# Altium schematic sheet TSAL.SchDoc: QUTMS - HVBoard - TSAL
size A4; Author: Jonn Dillon; Organization: QUT Motorsport; Address1: O-120; Address2: O Block; Address3: QUT Gardens Point; Address4: Brisbane, 4000; DocumentNumber: 3; SheetNumber: 3; SheetTotal: 7
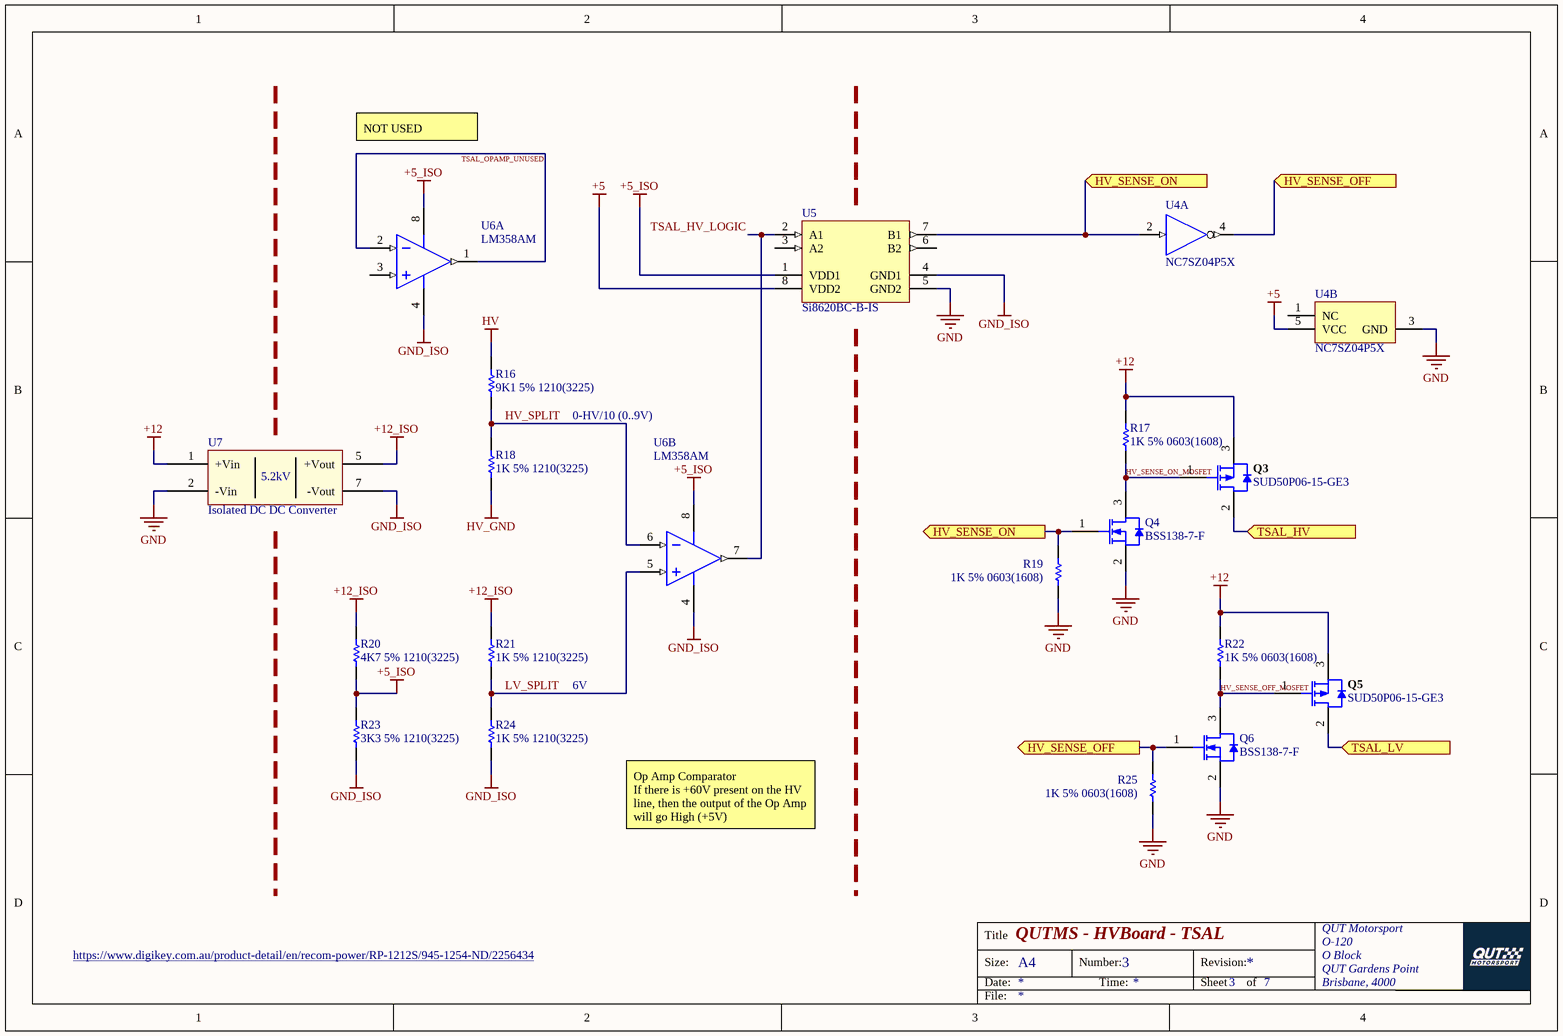
[diagram p0: TSAL.SchDoc]

## Parts
Q3  SUD50P06-15-GE3  [VSIL-TO-252AA-3_V]
Q4  BSS138-7-F  [DIOD-SOT23-3_V]
Q5  SUD50P06-15-GE3  [VSIL-TO-252AA-3_V]
Q6  BSS138-7-F  [DIOD-SOT23-3_V]
R16  9K1 5% 1210(3225)  [RESC1210(3225)_N]
R17  1K 5% 0603(1608)  [RESC0603(1608)_L]
R18  1K 5% 1210(3225)  [RESC1210(3225)_N]
R19  1K 5% 0603(1608)  [RESC0603(1608)_L]
R20  4K7 5% 1210(3225)  [RESC1210(3225)_N]
R21  1K 5% 1210(3225)  [RESC1210(3225)_N]
R22  1K 5% 0603(1608)  [RESC0603(1608)_L]
R23  3K3 5% 1210(3225)  [RESC1210(3225)_N]
R24  1K 5% 1210(3225)  [RESC1210(3225)_N]
R25  1K 5% 0603(1608)  [RESC0603(1608)_L]
U4  NC7SZ04P5X  [FAIR-SC70-5_V]  (parts A,B of 2)
U5  Si8620BC-B-IS  [SLAB-SOIC-8-NB_M]
U6  LM358AM  [D0008A_N]  (parts A,B of 2)
U7  Isolated DC DC Converter  [RP1212S]

## Ports
HV_SENSE_OFF (in), HV_SENSE_OFF (out), HV_SENSE_ON (in), HV_SENSE_ON (out), TSAL_HV (in), TSAL_LV (in)

## Nets
+5: U4.5(VCC) U5.8(VDD2)
+5_ISO: R20.1 R23.2 U5.1(VDD1) U6.8(V+)
+12: Q3.3(S) Q5.3(S) R17.2 R22.2 U7.1(+Vin)
+12_ISO: R20.2 R21.2 U7.5(+Vout)
GND: Q4.2(S) Q6.2(S) R19.1 R25.1 U4.3(GND) U5.5(GND2) U7.2(-Vin)
GND_ISO: R23.1 R24.1 U5.4(GND1) U6.4(GND) U7.7(-Vout)
HV: R16.2
HV_GND: R18.1
HV_SENSE_OFF: Q6.1(G) R25.2 U4.4(Y) ; port HV_SENSE_OFF
HV_SENSE_OFF_MOSFET: Q5.1(G) Q6.3(D) R22.1
HV_SENSE_ON: Q4.1(G) R19.2 U4.2(A) U5.7(B1) ; port HV_SENSE_ON
HV_SENSE_ON_MOSFET: Q3.1(G) Q4.3(D) R17.1
HV_SPLIT: R16.1 R18.2 U6.6(INB-)
LV_SPLIT: R21.1 R24.2 U6.5(INB+)
TSAL_HV: Q3.2(D) ; port TSAL_HV
TSAL_HV_LOGIC: U5.2(A1) U6.7(OUTB)
TSAL_LV: Q5.2(D) ; port TSAL_LV
TSAL_OPAMP_UNUSED: U6.1(OUTA) U6.2(INA-)

Not connected (* = marked no-connect by the designer): U4 1(NC); U5 3(A2) 6(B2); U6 3(INA+)

## Notes on the sheet
- NOT USED
- 0-HV/10 (0..9V)
- 6V
- Op Amp Comparator
  If there is +60V present on the HV line, then the output of the Op Amp will go High (+5V)
- https://www.digikey.com.au/product-detail/en/recom-power/RP-1212S/945-1254-ND/2256434
- Title
- Size:
- Date:
- A4
- Number:
- Time:
- Revision:
- Sheet
- of
- File:
- (in symbol RP-1212S) 5.2kV

## Library data of the parts
Q3 Q5 = CMP-2000-05431-1: P-Channel (D-S) MOSFET, 30 V, -55 to 150 degC, 3-Pin TO-252, RoHS, Tape and Reel; Manufacturer: Vishay; Unit Weight: 0.050717oz; Id - Continuous Drain Current: 50A; Rise Time: 70ns; Fall Time: 175ns; Configuration: Single; Rds On - Drain-Source Resistance: 15mOhms; Transistor Type: 1P-Channel; Channel Mode: Enhancement; Number of Channels: 1Channel; Typical Turn-On Delay Time: 15ns; Brand: VishaySemiconductors; Pd - Power Dissipation: 2.5W; Vds - Drain-Source Breakdown Voltage: -60V; Vgs - Gate-Source Voltage: 20V; Mounting Style: SMD/SMT; Package / Case: TO-252AA-3; Height: 2.39mm; Datasheet Version: Rev. C, 07/2013; Factory Pack Quantity: 2000; RoHS: True; Typical Turn-Off Delay Time: 175ns; Minimum Operating Temperature: -55C; Tradename: TrenchFET; Manufacturer URL: http://www.vishay.com/; Package Description: 3-Pin Surface Mount Device, Body 6.54 x 6.095 mm, Pitch 2.28 mm; Package Reference: TO-252; Transistor Polarity: P-Channel; Technology: Si; Series: SUD; Datasheet URL: https://datasheet.ciiva.com/4444/sud50p06-244530-4444327.pdf; Width: 6.22mm; Product Category: MOSFET; Packaging: Reel; Length: 6.73mm; Package URL: http://www.vishay.com/docs/89975/v15wl45c-m3.pdf; Maximum Operating Temperature: +150C
Q4 Q6 = CMP-2000-04930-1: N-Channel Enhancement Mode Mosfet, 50 V, 0.2 A, -55 to 150 degC, 3-Pin SOT23, RoHS, Tape and Reel; Manufacturer: Diodes Inc; Brand: DiodesIncorporated; Unit Weight: 0.000282oz; Pd - Power Dissipation: 300mW; Id - Continuous Drain Current: 200mA; Rds On - Drain-Source Resistance: 3.5Ohms; Vgs - Gate-Source Voltage: 20V; Number of Channels: 1Channel; Vds - Drain-Source Breakdown Voltage: 50V; Transistor Type: 1N-Channel; Typical Turn-Off Delay Time: 20ns; Configuration: Single; Mounting Style: SMD/SMT; Height: 1mm; Package Description: 3-Pin Small Outline Transistor, Body 2.9 x 1.3 mm, Pitch 0.96 mm; Datasheet Version: Rev. 20-2, 11/2013; Minimum Operating Temperature: -55C; Package / Case: SOT-23-3; Channel Mode: Enhancement; Product: MOSFETSmallSignal; Packaging: Reel; Maximum Operating Temperature: +150C; Datasheet URL: https://datasheet.ciiva.com/8115/ds30144-8115344.pdf; Product Category: MOSFET; Width: 1.3mm; Technology: Si; Package Reference: SOT23-3; Manufacturer URL: http://www.diodes.com/; Transistor Polarity: N-Channel; Length: 2.9mm; Factory Pack Quantity: 3000; Series: BSS138; RoHS: True; Typical Turn-On Delay Time: 20ns
R16 = CMP-1015-00097-1: 9K1 0.5W 5% 1210 (3225 Metric)  SMD; Case-EIA: 1210; Value: 9100.00 Ohm; Case-Metric: 3225; Technology: SMT; Power: 0.5 W; Tolerance: 5 %
R17 R19 R22 R25 = CMP-1012-00074-1: 1K 0.1W 5% 0603 (1608 Metric)  SMD; Case-EIA: 0603; Case-Metric: 1608; Value: 1000.00 Ohm; Technology: SMT; Tolerance: 5 %; Power: 0.1 W
R18 R21 R24 = CMP-1015-00074-1: 1K 0.5W 5% 1210 (3225 Metric)  SMD; Case-EIA: 1210; Value: 1000.00 Ohm; Case-Metric: 3225; Power: 0.5 W; Technology: SMT; Tolerance: 5 %
R20 = CMP-1015-00090-1: 4K7 0.5W 5% 1210 (3225 Metric)  SMD; Value: 4700.00 Ohm; Case-Metric: 3225; Case-EIA: 1210; Technology: SMT; Tolerance: 5 %; Power: 0.5 W
R23 = CMP-1015-00086-1: 3K3 0.5W 5% 1210 (3225 Metric)  SMD; Value: 3300.00 Ohm; Case-EIA: 1210; Case-Metric: 3225; Technology: SMT; Tolerance: 5 %; Power: 0.5 W
U4 = CMP-2000-06814-1: TinyLogic(R) UHS Inverter, 32 mA, 1.65 to 5.5 V, -40 to 85 degC, 5-Pin SOT23 (SC70), RoHS, Tape and Reel; Manufacturer: FairchildSemiconductor; Maximum Propagation Delay Time @ Maximum CL: 5@3.3V; Typical Operating Supply Voltage: 1.8; Number of Elements per Chip: 1; Rad Hard: No; Maximum Low Level Output Current: 32mA; Fabrication Technology: CMOS; Propagation Delay Test Condition: 50pF; Maximum High Level Output Current: -32mA; Logic Family: TinyLogicUHS; Package URL: https://www.fairchildsemi.com/package-drawings/MA/MAA05A.pdf; Datasheet Version: Rev. 1.0.5, 02/2011; Package Reference: SC70-5; Package Description: 5-Pin Small Outline Transistor, Body 2 x 1.25 mm, Pitch 0.65 mm; Mounting Technology: SurfaceMount; Logic Function: Inverter; Package: 5SC-70; Category: InverterSchmittTrigger; Packaging: Tape&Reel; Manufacturer URL: https://www.fairchildsemi.com/; Datasheet URL: https://www.fairchildsemi.com/datasheets/NC/NC7SZ04.pdf; Operating Temperature: -40to85°C
U5 = CMP-0512-00372-1: Low-Power Single and Dual-Channel Digital Isolator, 150 Mbps, 3.75 kVRMS Isolation Rating, -40 to 125 degC, 8-pin SOIC; Manufacturer: Silicon Labs; Isolation Rating (kV): 3.75; Channel Type: Unidirectional; AEC-Q100: TRUE; Sub-Family: Isolators; Maximum Propagation Delay (ns): 13; 10kV surge: FALSE; Maximum Data Rate (Mbps): 150; DatasheetVersion: Rev. 1.3; ComponentLink3URL: http://www.silabs.com/Support%20Documents/TechnicalDocs/Si8220-21.pdf; PackageDescription: 8-Pin Narrow Body Plastic Small Outline, Body 4.9 x 3.9 mm, Pitch 1.27 mm; ComponentLink2Description: Datasheet; ComponentLink3Description: Package Specification; ComponentLink1URL: http://www.silabs.com/; ComponentLink1Description: Manufacturer URL; Mounting Technology: Surface Mount; PartNumber: Si8620BC-B-IS; ComponentLink2URL: http://www.silabs.com/Support%20Documents/TechnicalDocs/Si861x-2x.pdf; Enable Control: FALSE; PackageReference: SOIC-8-NB
U6 = CMP-0055-00796-3: Low Power Dual Operational Amplifier, 8-pin Narrow SOIC; Manufacturer: Texas Instruments; CompType: Amplifiers; PackageTopMarking: NSZXTT*LM*358AM; PowerWise: N; Code_JEDEC: MS-012-AA; RoHS: N; PinCount: 8; Package Reference: D0008A; ComponentLink1Description: Datasheet URL; ComponentLink1URL: http://www.ti.com/general/docs/lit/getliterature.tsp?genericPartNumber=LM358-N&fileType=pdf; Code_IPC: SOIC127P600-8; PackageDescription: SOIC Narrow, 4.9 x 3.9 x 1.45mm, 8 Lead, 1.27mm Pitch
U7 = RP-1212S: ComponentLink1Description: DigiKey; ComponentLink1URL: https://www.digikey.com.au/product-detail/en/recom-power/RP-1212S/945-1254-ND/2256434; ComponentLink2Description: Datasheet; ComponentLink2URL: https://www.recom-power.com/pdf/Econoline/RP.pdf